# EAGLE schematic Board Layout (EAGLE 6.4)
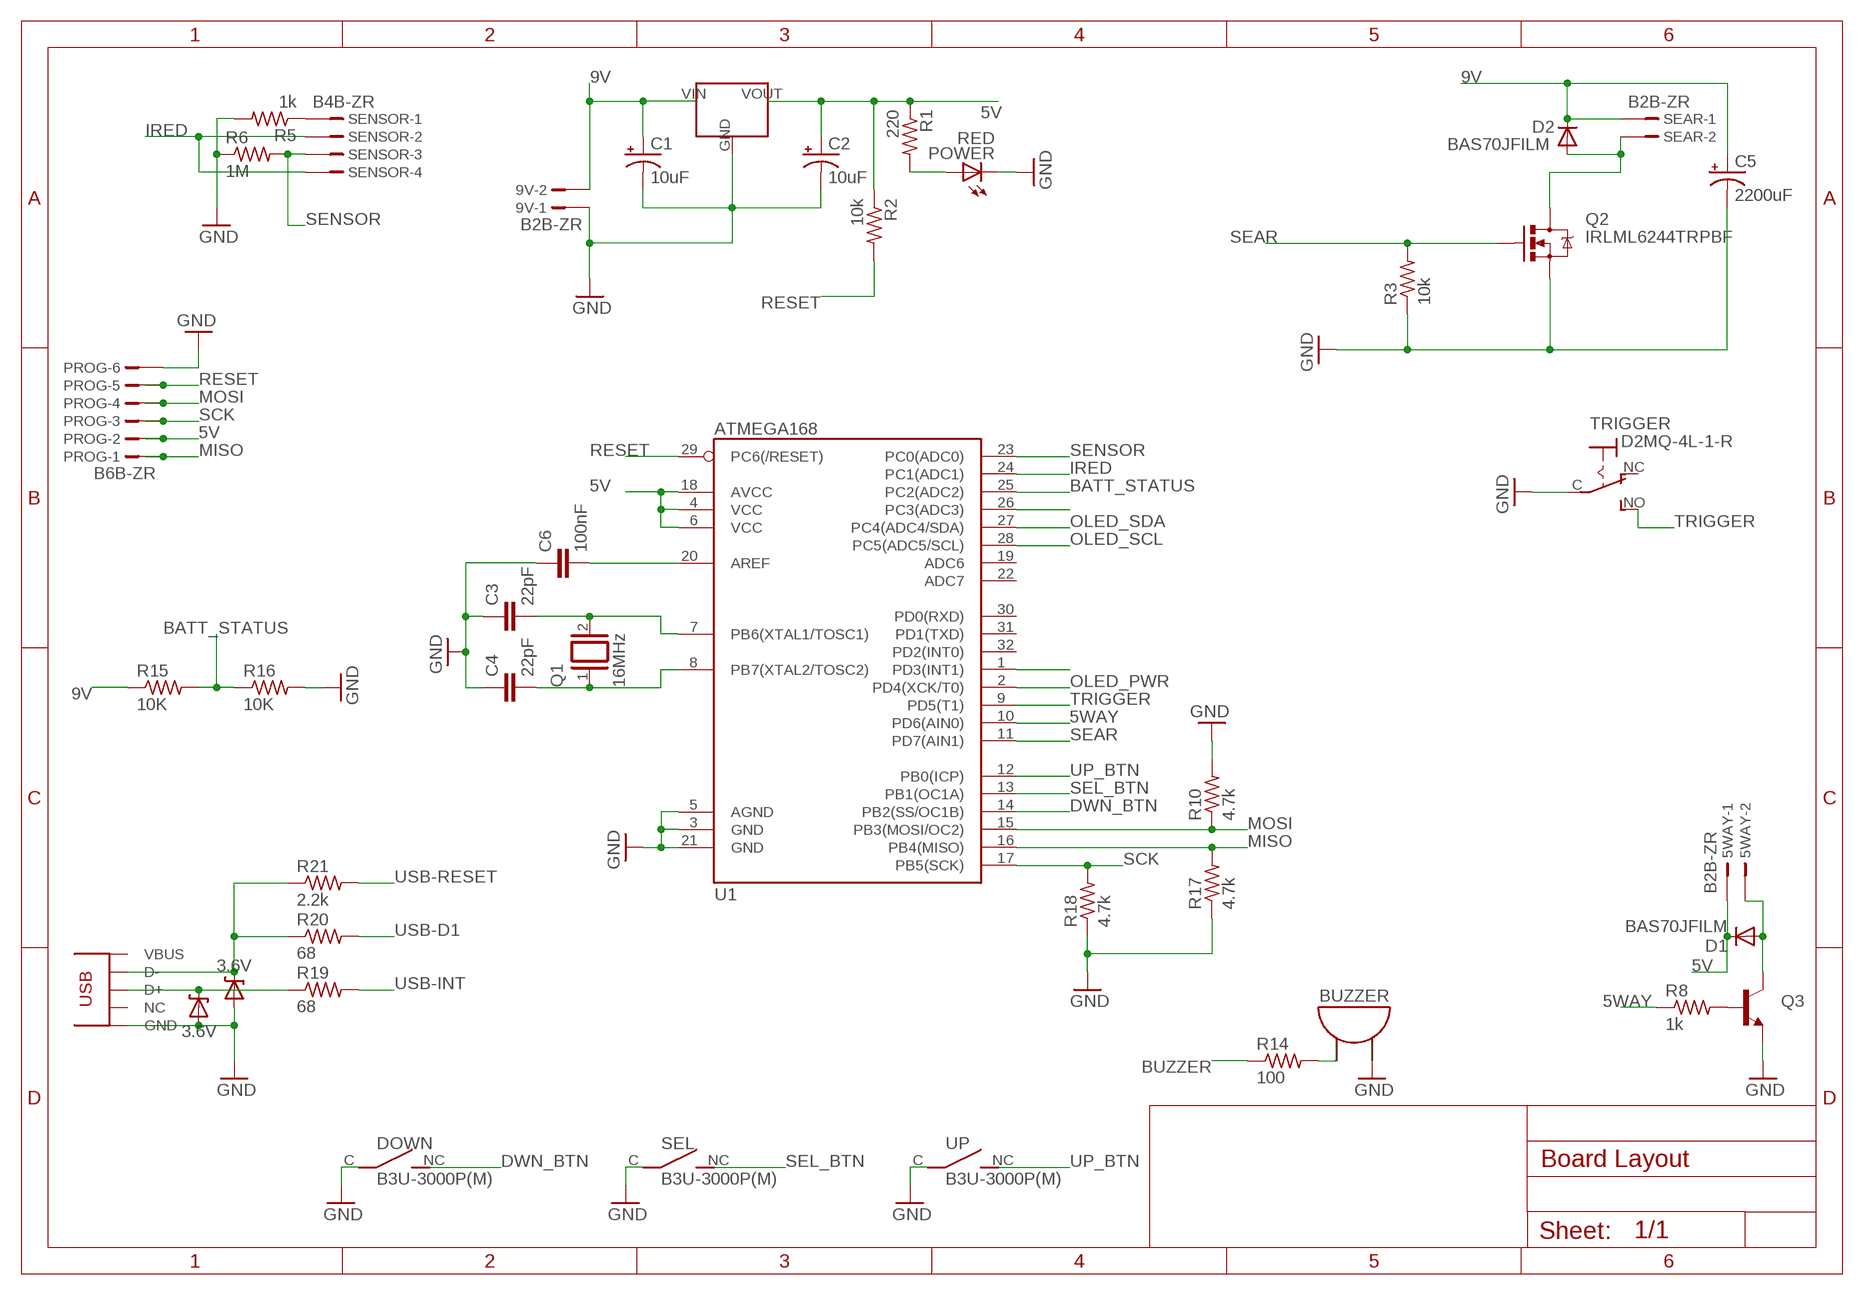
[diagram p0: schematic, sheet 1]

## Parts
3.6V  3.6V  DIODE-ZENER-BZT52  [SOD-323]
5WAY  B2B-ZR  [B2B-ZR]
9V  B2B-ZR  [B2B-ZR]
BUZZER  KPEG171  [KPEG171]
C1  10uF  AVESMB  [AVES***M**B]
C2  10uF  AVESMB  [AVES***M**B]
C3  22pF  CAP0402-CAP  [0402-CAP]
C4  22pF  CAP0402-CAP  [0402-CAP]
C5  2200uF  AVESMB  [AVES***M**B]
C6  100nF  CAP0402-CAP  [0402-CAP]
D1  BAS70JFILM  DIODESOD  [SOD-323]
D2  BAS70JFILM  DIODESOD  [SOD-323]
DOWN  B3U-3000P(M)  [B3U-3000P(M)]
MAX603  7805  L78M05C  [SOT-89]
POWER  RED  LEDCHIP-LED0603  [CHIP-LED0603]
PROG  B6B-ZR  [B6B-ZR]
Q1  16MHz  XTAL/S  [QS]
Q2  IRLML6244TRPBF  MOSFET-NCHANNELSMD  [SOT23-3]
Q3  TRANSISTOR_NPNSOT89  [SOT89]
R1  220  R-US_R0603  [R0603]
R2  10k  R-US_R0603  [R0603]
R3  10k  R-US_R0603  [R0603]
R5  1k  R-US_R0603  [R0603]
R6  1M  R-US_R0603  [R0603]
R8  1k  R-US_R0603  [R0603]
R10  4.7k  R-US_R0603  [R0603]
R14  100  R-US_R0603  [R0603]
R15  10K  R-US_R0603  [R0603]
R16  10K  R-US_R0603  [R0603]
R17  4.7k  R-US_R0603  [R0603]
R18  4.7k  R-US_R0603  [R0603]
R19  68  R-US_R0603  [R0603]
R20  68  R-US_R0603  [R0603]
R21  2.2k  R-US_R0603  [R0603]
SEAR  B2B-ZR  [B2B-ZR]
SEL  B3U-3000P(M)  [B3U-3000P(M)]
SENSOR  B4B-ZR  [B4B-ZR]
TRIGGER  D2MQ-4L-1-R  [D2MQ-4L-1-R]
U1  ATMEGA168  [TQFP32-08]
U$2  3.6V  DIODE-ZENER-BZT52  [SOD-323]
U$3  USB-MINI-B-VERT  [USB-MINI-B-VERT]
UP  B3U-3000P(M)  [B3U-3000P(M)]

## Nets
5V: 5WAY.1 C2.P$1+(+) D1.1(C) MAX603.VOUT(OUT) PROG.2 R1.1 R2.1 U1.4(VCC) U1.6(VCC) U1.18(AVCC)
5WAY: R8.1 U1.10(PD6(AIN0))
9V: 9V.2 C1.P$1+(+) C5.P$1+(+) D2.1(C) MAX603.VIN(IN) R15.1 SEAR.1
BATT_STATUS: R15.2 R16.1 U1.25(PC2(ADC2))
BUZZER: R14.1
DWN_BTN: DOWN.NC(NO) U1.14(PB2(SS/OC1B))
GND: 3.6V.2(A) 9V.1 BUZZER.2(PB2) C1.P$2-(-) C2.P$2-(-) C3.1 C4.1 C5.P$2-(-) C6.1 DOWN.C POWER.C PROG.6 Q2.2(S) Q3.3(E) R3.1 R5.2 R6.1 R10.2 R16.2 R17.1 R18.1 SEL.C TRIGGER.C(P) U1.3(GND) U1.5(AGND) U1.21(GND) U$2.2(A) UP.C
IRED: SENSOR.2 SENSOR.4 U1.24(PC1(ADC1))
MISO: PROG.1 R17.2 U1.16(PB4(MISO))
MOSI: PROG.4 R10.1 U1.15(PB3(MOSI/OC2))
N$1: C3.2 Q1.2 U1.7(PB6(XTAL1/TOSC1))
N$2: C4.2 Q1.1 U1.8(PB7(XTAL2/TOSC2))
N$3: C6.2 U1.20(AREF)
N$6: POWER.A R1.2
N$7: D2.2(A) Q2.3(D) SEAR.2
N$9: R5.1 SENSOR.1
N$10: R20.1 R21.1 U$2.1(C)
N$11: 3.6V.1(C) R19.1
N$12: U1.26(PC3(ADC3))
N$15: 5WAY.2 D1.2(A) Q3.2(C)
N$16: U1.1(PD3(INT1))
N$17: Q3.1(B) R8.2
N$19: BUZZER.1(PB1) R14.2
OLED_PWR: U1.2(PD4(XCK/T0))
OLED_SCL: U1.28(PC5(ADC5/SCL))
OLED_SDA: U1.27(PC4(ADC4/SDA))
RESET: PROG.5 R2.2 U1.29(PC6(/RESET))
SCK: PROG.3 R18.2 U1.17(PB5(SCK))
SEAR: R3.2 U1.11(PD7(AIN1))
SEL_BTN: SEL.NC(NO) U1.13(PB1(OC1A))
SENSOR: R6.2 SENSOR.3 U1.23(PC0(ADC0))
TRIGGER: TRIGGER.NO(S) U1.9(PD5(T1))
UP_BTN: U1.12(PB0(ICP)) UP.NC(NO)
USB-D1: R20.2
USB-INT: R19.2
USB-RESET: R21.2
Unconnected: MAX603.GND Q2.1(G) TRIGGER.NC(O) U1.19(ADC6) U1.22(ADC7) U1.30(PD0(RXD)) U1.31(PD1(TXD)) U1.32(PD2(INT0)) U$3.D+ U$3.D- U$3.GND U$3.ID(NC) U$3.VBUS

## Library data of the parts
3.6V U$2 = SparkFun:DIODE-ZENER: Zener Diode Production Part - 8199 3.4V Zener Voltage; VAL: 3.6V
5WAY 9V SEAR = Parts:B2B-ZR: ZH CONNECTOR 1.5 mm, 2 pin 1 row Source: http://www.jst.com .. eZH.pdf
BUZZER = Parts:KPEG171
C1 C2 C5 = Parts:AVES***M**B
C3 C4 C6 = SparkFun:CAP: Capacitor Standard 0603 ceramic capacitor, and 0.1" leaded capacitor.
D1 D2 = SparkFun:DIODE: Diode These are standard reverse protection diodes and small signal diodes. SMA package can handle up to about 1A. SOD-323 can handle about 200mA. What the SOD-323 package when ordering, there are some mfgs out there that are 5-pin packages.
DOWN SEL UP = Parts:B3U-3000P(M)
MAX603 = Parts:L78M05C
POWER = led:LED: LED OSRAM: - CHIPLED LG R971, LG N971, LY N971, LG Q971, LY Q971, LO R971, LY R971 LH N974, LH R974 LS Q976, LO Q976, LY Q976 LO Q996 - Hyper CHIPLED LW Q18S LB Q993, LB Q99A, LB R99A - SideLED LS A670, LO A670, LY A670, LG A670, LP A670 LB A673, LV A673, LT A673, LW A673 LH A674 LY A675 LS A676, LA A676, LO A676, LY A676, LW A676 LS A679, LY A679, LG A679 - Hyper Micro SIDELED® LS Y876, LA Y876, LO Y876, LY Y876 LT Y87S - SmartLED LW L88C, LW L88S LB L89C, LB L89S, LG L890 LS L89K, LO L89K, LY L89K LS L896, LA L896, LO L896, LY L896 - TOPLED LS T670, LO T670, LY T670, LG T670, LP T670 LSG T670, LSP T670, LSY T670, LOP T670, LYG T670 LG T671, LOG T671, LSG T671 LB T673, LV T673, LT T673, LW T673 LH T674 LS T676, LA T676, LO T676, LY T676, LB T676, LH T676, LSB T676, LW T676 LB T67C, LV T67C, LT T67C, LS T67K, LO T67K, LY T67K, LW E67C LS E67B, LA E67B, LO E67B, LY E67B, LB E67C, LV E67C, LT E67C LW T67C LS T679, LY T679, LG T679 LS T770, LO T770, LY T770, LG T770, LP T770 LB T773, LV T773, LT T773, LW T773 LH T774 LS E675, LA E675, LY E675, LS T675 LS T776, LA T776, LO T776, LY T776, LB T776 LHGB T686 LT T68C, LB T68C - Hyper Mini TOPLED® LB M676 - Mini TOPLED Santana® LG M470 LS M47K, LO M47K, LY M47K Source: http://www.osram.convergy.de LUXEON: - LUMILED® LXK2-PW12-R00, LXK2-PW12-S00, LXK2-PW14-U00, LXK2-PW14-V00 LXK2-PM12-R00, LXK2-PM12-S00, LXK2-PM14-U00 LXK2-PE12-Q00, LXK2-PE12-R00, LXK2-PE12-S00, LXK2-PE14-T00, LXK2-PE14-U00 LXK2-PB12-K00, LXK2-PB12-L00, LXK2-PB12-M00, LXK2-PB14-N00, LXK2-PB14-P00, LXK2-PB14-Q00 LXK2-PR12-L00, LXK2-PR12-M00, LXK2-PR14-Q00, LXK2-PR14-R00 LXK2-PD12-Q00, LXK2-PD12-R00, LXK2-PD12-S00 LXK2-PH12-R00, LXK2-PH12-S00 LXK2-PL12-P00, LXK2-PL12-Q00, LXK2-PL12-R00 Source: www.luxeon.com KINGBRIGHT: KA-3528ASYC Source: www.kingbright.com
PROG = Parts:B6B-ZR: ZH CONNECTOR 1.5 mm, 6 pin 1 row Source: http://www.jst.com .. eZH.pdf
Q1 = special:XTAL/S: CRYSTAL
Q2 = SparkFun:MOSFET-NCHANNEL
Q3 = SparkFun:TRANSISTOR_NPN: Transistor NPN BJT configuration in SOT23 package. MMBT2222 is the common NPN we use. Double check BCE configuration again layout.
R1-R3 R5 R6 R8 R10 R14-R21 = resistor:R-US_: RESISTOR, American symbol
SENSOR = con-jst:?4B-ZR: ZH CONNECTOR 1.5 mm, 4 pin 1 row Source: http://www.jst.com .. eZH.pdf; MF: FARNELL; MPN: B4B-ZR(LF)(SN); OC_FARNELL: 1830916; OC_NEWARK: 37K9960
TRIGGER = Parts:D2MQ-4L-1-R: Snap-action Switch with Ultra Subminiature Size (6.5 x 8.2 x 2.7 mm)(HxWxD) Light Weight (0.3 g) Excellent electrical characteristics and a snap-action mechanism in spite of its ultra small size. Gold-plated (Au-P) contacts for micro load switching available in addition to silver-plated contacts (Ag-P). Ideal for applications where size is extremely limited and high reliability is demanded, such as in compact audio, optical, and telecommunications equipment.
U1 = SparkFun:ATMEGA168
U$3 = Parts:USB-MINI-B-VERT